# Altium schematic sheet SAMV71_Xplained_Ultra_MCU_Peripherals.SchDoc: Target MCU Peripherals
size A3; Organization: ATMEL Norway; Address1: Vestre Rosten 79; Address2: N-7075 TILLER; Address3: NORWAY; DocumentNumber: A09-2407; Revision: 11; SheetNumber: 6; SheetTotal: 13; DrawnBy: Microchip Norway; Engineer: AH; PageSetup: Record=PageOptions|CenterHorizontal=True|CenterVertical=True|PrintScale=1.01|XCorrection=1.00|YCorrection=1.00|PrintKind=1|BorderSize=5000000|LeftOffset=0|BottomOffset=0|Orientation=2|PaperLength=1000|PaperWidth=1000|Scale=100|PaperSource=7|PrintQuality=-4|MediaType=1|DitherType=10|PaperKind=A3 (297 x 420 mm)|PrintScaleMode=1; ProjectTitle: SAM V71 Xplained Ultra; PCBNumber: A08-2216; PCBRevision: 4
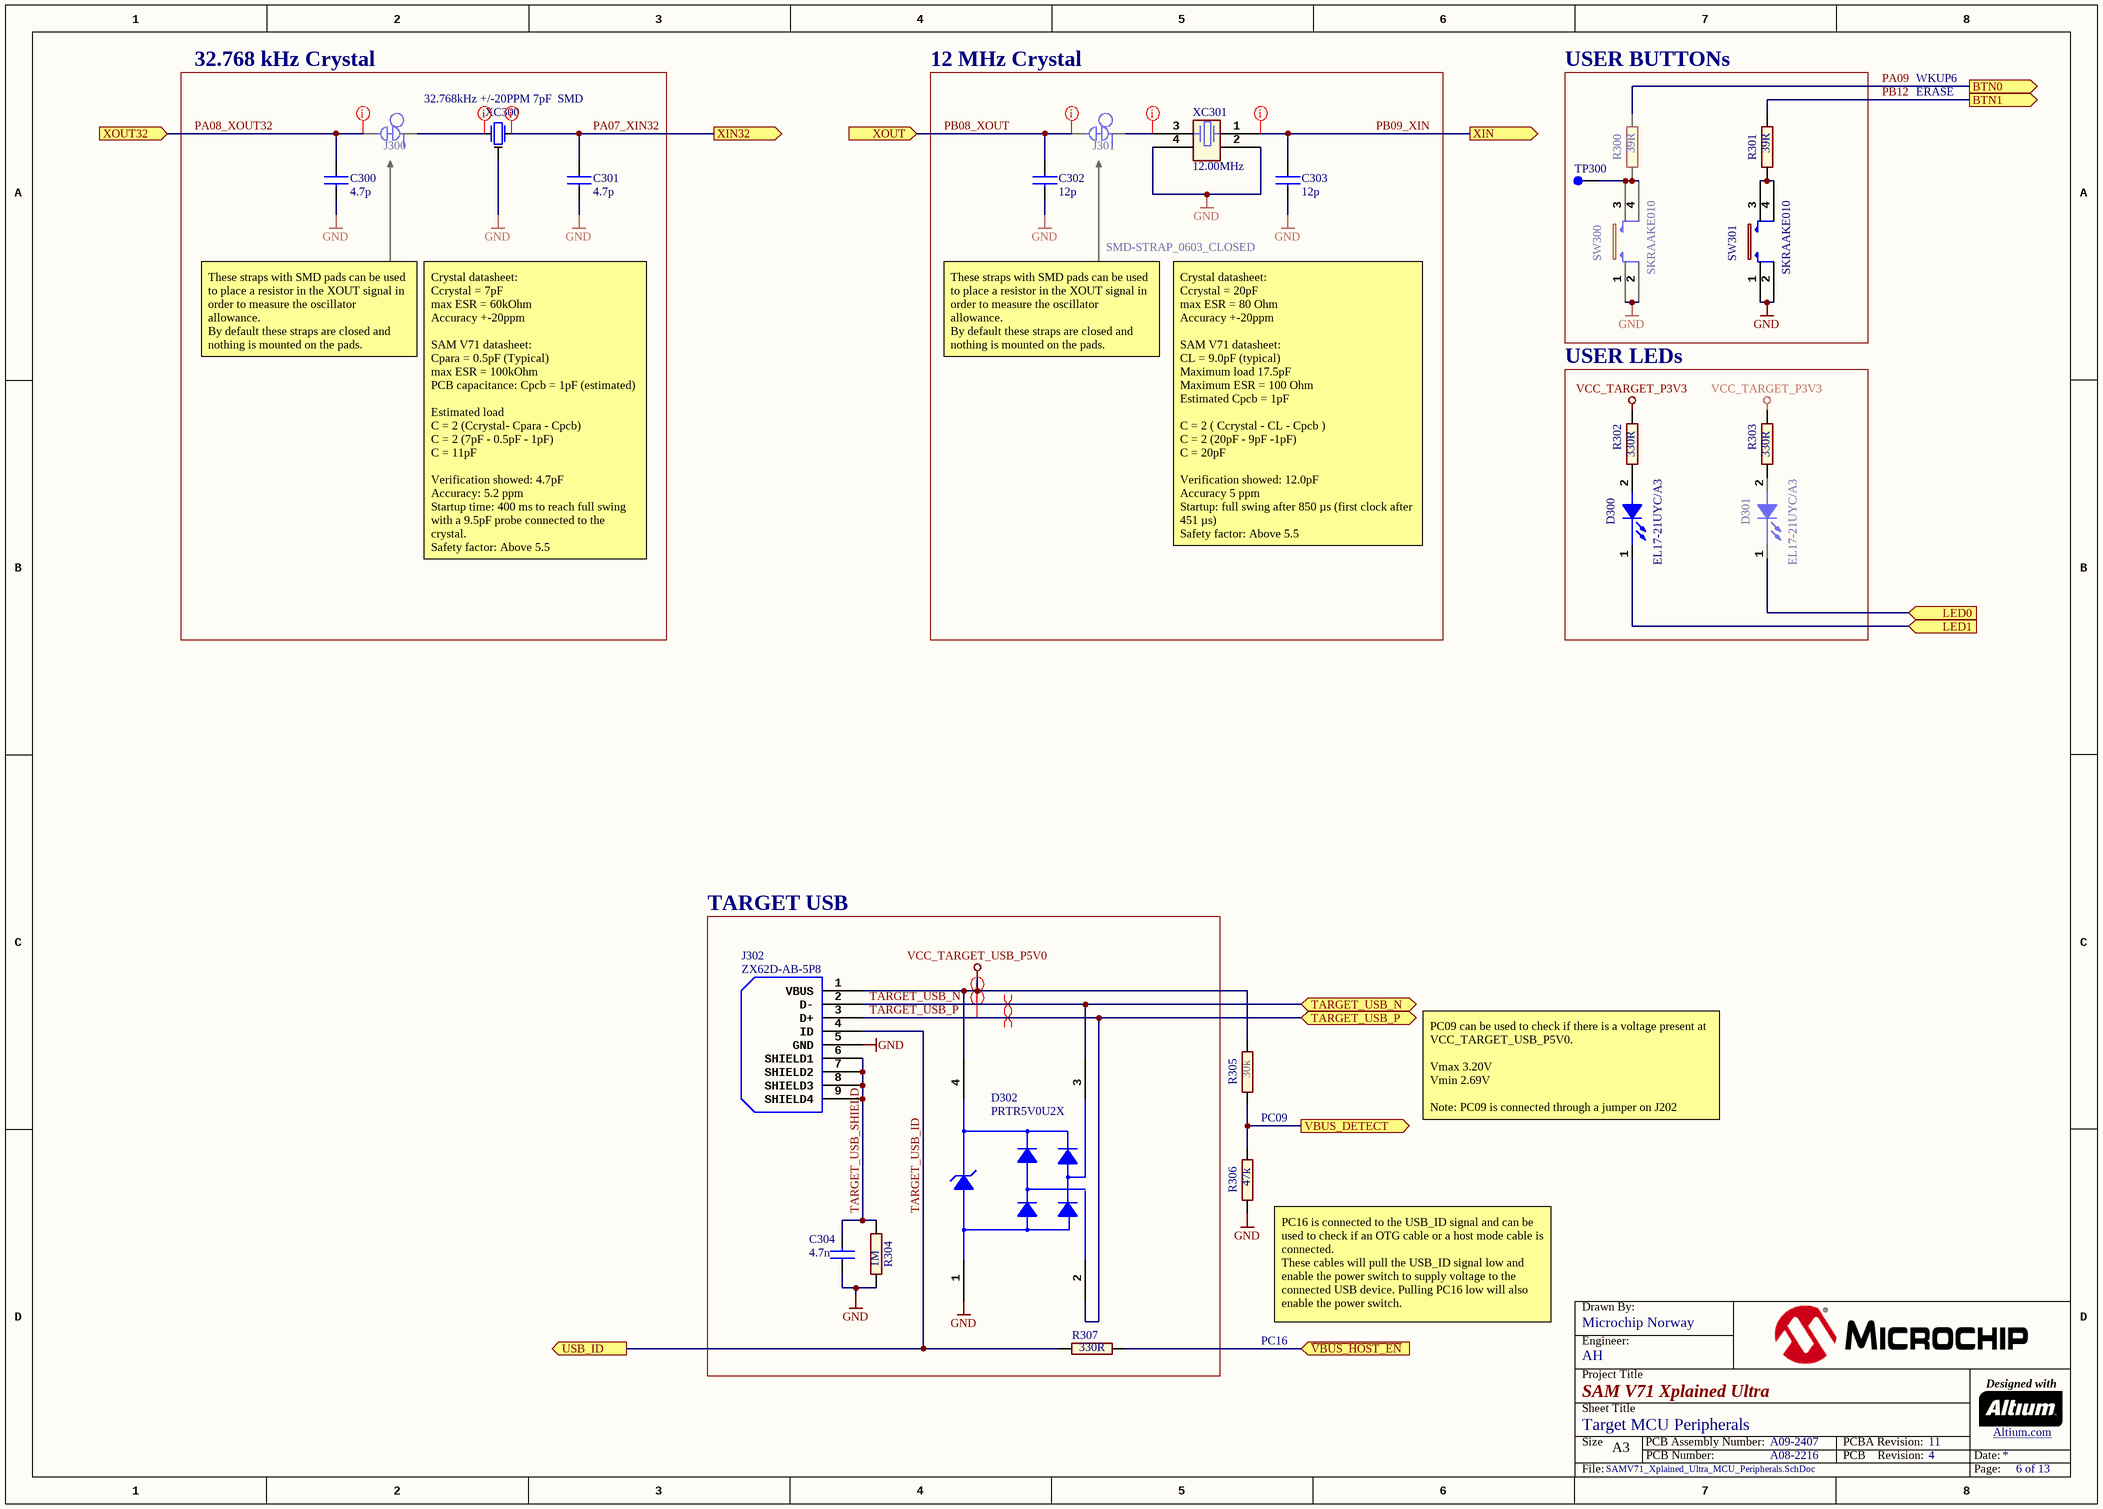
[diagram p0: SAMV71_Xplained_Ultra_MCU_Peripherals.SchDoc]

## Parts
C300  value 4.7p  [AP1-00001]
C301  value 4.7p  [AP1-00001]
C302  value 12p  [AP1-00001]
C303  value 12p  [AP1-00001]
C304  value 4.7n  [AP1-00053]
D300  value EL17-21UYC/A3  [AP4-00013]
D301  value EL17-21UYC/A3  [AP4-00013]
D302  value PRTR5V0U2X  [AP4-00001]
J300  (no value)  [AP9-00044]  (net tie, no BOM)
J301  value SMD-STRAP_0603_CLOSED  [AP9-00044]  (net tie, no BOM)
J302  value ZX62D-AB-5P8  [AP8-00852]  (hidden comment: 2,000 pieces per reel)
R300  value 39R  [AP2-00011]
R301  value 39R  [AP2-00011]
R302  value 330R  [AP2-00000]
R303  value 330R  [AP2-00000]
R304  value 1M  [AP2-00011]
R305  value 30k  [AP2-00000]
R306  value 47k  [AP2-00000]
R307  value 330R  [AP2-00000]
SW300  value SKRAAKE010  [AP8-00137]  (hidden comment: same as A08-0091 but less force is needed; Can be ordered in low volumes from Mouser)
SW301  value SKRAAKE010  [AP8-00137]  (hidden comment: same as A08-0091 but less force is needed; Can be ordered in low volumes from Mouser)
TP300  (no value)  [AP8-00010]  (no BOM)
XC300  value 32.768kHz +/-20PPM 7pF  SMD  [AP7-00044]  (hidden comment: Farnell order no:1539364)
XC301  value 12.00MHz  [AP7-00039]

## Blocks framed on the sheet
32.768 kHz Crystal: C300 C301 J300 XC300
12 MHz Crystal: C302 C303 J301 XC301
USER BUTTONs: R300 R301 SW300 SW301 TP300
USER LEDs: D300 D301 R302 R303
TARGET USB: C304 D302 J302 R304 R307

## Ports
BTN0 (out), BTN1 (out), LED0 (in), LED1 (in), TARGET_USB_N (bidir), TARGET_USB_P (bidir), USB_ID (out), VBUS_DETECT (out), XIN32 (out), XIN (out), XOUT32 (in), XOUT (in), ~{VBUS_HOST_EN} (in)

## Nets
GND: C300.2 C301.2 C302.2 C303.2 C304.1 D302.1(GND) J302.5(GND) R304.1 R306.1 SW300.1 SW300.2 SW301.1 SW301.2 XC300.3 XC301.2 XC301.4
VCC_TARGET_P3V3: R302.2 R303.2
VCC_TARGET_USB_P5V0: D302.4(VCC) J302.1(VBUS) R305.2
LED0: D301.1(CATHODE) ; port LED0
LED1: D300.1(CATHODE) ; port LED1
PA07_XIN32: C301.1 XC300.2 ; port XIN32
PA08_XOUT32: C300.1 J300.2 ; port XOUT32
PA09: R300.2 ; port BTN0
PB08_XOUT: C302.1 J301.2 ; port XOUT
PB09_XIN: C303.1 XC301.1 ; port XIN
PB12: R301.2 ; port BTN1
TARGET_USB_ID: J302.4(ID) R307.1 ; port USB_ID
TARGET_USB_N: D302.3(I/O_2) J302.2(D-) ; port TARGET_USB_N
TARGET_USB_P: D302.2(I/O_1) J302.3(D+) ; port TARGET_USB_P
TARGET_USB_SHIELD: C304.2 J302.6(SHIELD1) J302.7(SHIELD2) J302.8(SHIELD3) J302.9(SHIELD4) R304.2
~{VBUS_HOST_EN}: R307.2 ; port ~{VBUS_HOST_EN}
VBUS_DETECT: R305.1 R306.2 ; port VBUS_DETECT
NetD300_2: D300.2(ANODE) R302.1
NetD301_2: D301.2(ANODE) R303.1
NetJ300_1: J300.1 XC300.1
NetJ301_1: J301.1 XC301.3
NetR300_1: R300.1 SW300.3 SW300.4 TP300.1
NetR301_1: R301.1 SW301.3 SW301.4

## Layout directives
differential pair: TARGET_USB_N, TARGET_USB_P
rule Assembly Testpoint Usage [Testpoint - Not Allowed    Multiple - Not Allowed]; rule Fabrication Testpoint Usage [Testpoint - Not Allowed    Multiple - Not Allowed]: NetJ300_1, NetJ301_1, PA07_XIN32, PA08_XOUT32, PB08_XOUT, PB09_XIN, TARGET_USB_N, TARGET_USB_P

## Notes on the sheet
- WKUP6
- ERASE
- These straps with SMD pads can be used to place a resistor in the XOUT signal in order to measure the oscillator allowance.
  By default these straps are closed and nothing is mounted on the pads.
- Crystal datasheet:
  Ccrystal = 7pF
  max ESR = 60kOhm
  Accuracy +-20ppm
  SAM V71 datasheet:
  Cpara = 0.5pF (Typical)
  max ESR = 100kOhm
  PCB capacitance: Cpcb = 1pF (estimated)
  Estimated load
  C = 2 (Ccrystal- Cpara - Cpcb)
  C = 2 (7pF - 0.5pF - 1pF)
  C = 11pF
  Verification showed: 4.7pF
  Accuracy: 5.2 ppm
  Startup time: 400 ms to reach full swing with a 9.5pF probe connected to the crystal.
  Safety factor: Above 5.5
- Crystal datasheet:
  Ccrystal = 20pF
  max ESR = 80 Ohm
  Accuracy +-20ppm
  SAM V71 datasheet:
  CL = 9.0pF (typical)
  Maximum load 17.5pF
  Maximum ESR = 100 Ohm
  Estimated Cpcb = 1pF
  C = 2 ( Ccrystal - CL - Cpcb )
  C = 2 (20pF - 9pF -1pF)
  C = 20pF
  Verification showed: 12.0pF
  Accuracy 5 ppm
  Startup: full swing after 850 µs (first clock after 451 µs)
  Safety factor: Above 5.5
- PC09
- PC09 can be used to check if there is a voltage present at VCC_TARGET_USB_P5V0.
  Vmax 3.20V
  Vmin 2.69V
  Note: PC09 is connected through a jumper on J202
- (near R306) PC16 is connected to the USB_ID signal and can be used to check if an OTG cable or a host mode cable is connected.
  These cables will pull the USB_ID signal low and enable the power switch to supply voltage to the connected USB device. Pulling PC16 low will also enable the power switch.
- PC16
- Drawn By:
- Project Title
- Engineer:
- Designed with
- Sheet Title
- Size
- A3
- PCB Number:
- PCB Assembly Number:
- PCBA Revision:
- PCB    Revision:
- Date:
- Altium.com <http://go.altium.com/MicrochipLandingPage_Evaluation.html>
- File:
- Page:

## Library data of the parts
C300 C301 = A01-0011: Ceramic capacitor, SMD 0402, NP0, 50V, +/-0.25pF; PartGroup: Capacitors,Ceramic,SMD 0402; Manufacturer: YAGEO CORP; MPN: CC0402CRNPO9BN4R7; TemperatureRange: -55 - +125 deg C; Status: Active; AN: A01-0011; Tolerance: 50V, +/-0.25pF; Height: 0,550000011920929
C302 C303 = A01-0016: Ceramic capacitor, SMD 0402, NP0, 50V, +/-5%; PartGroup: Capacitors,Ceramic,SMD 0402; Manufacturer: Kemet; MPN: C0402C120J5GAC7867; TemperatureRange: -55 - +125 deg C; Status: Active; AN: A01-0016; Tolerance: 50V, +/-5%; Height: 0,550000011920929
C304 = A01-0046: Ceramic capacitor, SMD 0402, X7R, 25V, +/-10%; PartGroup: Capacitors,Ceramic,SMD 0402; Manufacturer: PHYCOMP; MPN: 2238 587 15632; TemperatureRange: -55 - +125 deg C; Status: Active; AN: A01-0046; Tolerance: 25V, +/-10%; Height: 0,550000011920929
D300 D301 = A10-0019: LED, Yellow, Wave length=591nm, SMD 0805, ±70°; PartGroup: Opto,LEDs,SMD; Manufacturer: Everlight; MPN: 17-21UYC/S530-A3/TR8; TemperatureRange: -40 to +85 deg C; Status: Active; AN: A10-0019; Height: 1,10000002384186
D302 = A06-0236: Double rail-to-rail USB ESD protection diode; OrcadPartType: Integrated Circuits&Special function&Protection; Manufacturer: NXP; PartGroup: Integrated Circuits,Special function,Protection; TemperatureRange: -40 to +85 C; Status: Active; AN: A06-0236; PartType: Buy; Height: 1,10000002384186; MPN: PRTR5V0U2X
J300 = A09-0783: Default closed SMD strap, 0603 size; PartGroup: Mechanical devices,PCB implemented components; Value: SMD-STRAP_0603_CLOSED; AN: A09-0783; Height: 0
J301 = A09-0783: Default closed SMD strap, 0603 size; PartGroup: Mechanical devices,PCB implemented components; AN: A09-0783; Height: 0
J302 = A08-2112: Micro USB AB Connector, Standard SMT + DIP; PartGroup: Mechanical devices,Connectors,USB; Manufacturer: HIROSE; MPN: ZX62D-AB-5P8(30); Status: Active; AN: A08-2112; Height: 2,79999995231628
R300 R301 = A02-0178: Thick film resistor, SMD 0402, 1/16W, 1%; PartGroup: Resistors,SMD,0402 1%; Manufacturer: ASJ; MPN: CR10-39R0-FK; TemperatureRange: -55 - +125 deg C; Status: Active; AN: A02-0178; Tolerance: 1 %; Height: 0,349999994039536
R302 R303 R307 = A02-0200: Thick film resistor, SMD 0402, 1/16W, 1%; PartGroup: Resistors,SMD,0402 1%; Manufacturer: ASJ; MPN: CR10-3300-FK; TemperatureRange: -55 - +125 deg C; Status: Active; AN: A02-0200; Tolerance: 1 %; Height: 0,349999994039536
R304 = A02-0284: Thick film resistor, SMD 0402, 1/16W, 1%; PartGroup: Resistors,SMD,0402 1%; Manufacturer: ASJ; MPN: CR10-1004-FK; TemperatureRange: -55 - +125 deg C; Status: Active; AN: A02-0284; Tolerance: 1 %; Height: 0,349999994039536
R305 = A02-0247: Thick film resistor, SMD 0402, 1/16W, 1%; PartGroup: Resistors,SMD,0402 1%; Manufacturer: ASJ; MPN: CR10-3002-FK; TemperatureRange: -55ï¿½ to +155ï¿½C; Status: Active; AN: A02-0247; Tolerance: 1 %; Height: 0,349999994039536
R306 = A02-0252: Thick film resistor, SMD 0402, 1/16W, 1%; PartGroup: Resistors,SMD,0402 1%; Manufacturer: KOA; MPN: RK73H1ETTP4702F; TemperatureRange: -55 - +125 deg C; Status: Active; AN: A02-0252; Tolerance: 1 %; Height: 0,349999994039536
SW300 SW301 = A08-0790: 6.2x6.2 mm SMD tact switch, same as A08-0091 but less force is needed; PartGroup: Mechanical devices,Switches,SMD; Manufacturer: ALPS; TemperatureRange: -30 - +90 deg C; Status: Active; AN: A08-0790; Height: 5,09999990463257; MPN: SKRAAKE010
TP300 = A08-0004: Single SMD testpad; PartGroup: Mechanical devices,Connectors,Test points; Status: Active; AN: A08-0004; Height: 0; Value: TESTPAD
XC300 = A07-0052: 32k768 crystal, +-20ppm, CL=7pF, max ESR 60kOhm, SMD; PartGroup: Frequency devices,Crystals,SMD; Manufacturer: Micro Crystal; MPN: MS1V-T1K 32.768kHz 7pF +/-20PPM TA; Tolerance: +/- 20 PPM; TemperatureRange: -40 /+85; AN: A07-0052; Height: 2,07999992370605
XC301 = A07-0042: Fox FQ5032B 12.0MHz SMD crystal 738B-12; PartGroup: Frequency devices,Crystals,SMD; Manufacturer: Fox  Electronics; MPN: FQ5032B-12.000; Tolerance: Â±30ppm; TemperatureRange: 0Â°C ~ 70Â°C; Status: Active; AN: A07-0042; Height: 1,20000004768372